# Altium schematic sheet CON_VIDEO_OUT.SchDoc: Video Out Connectors
size A4
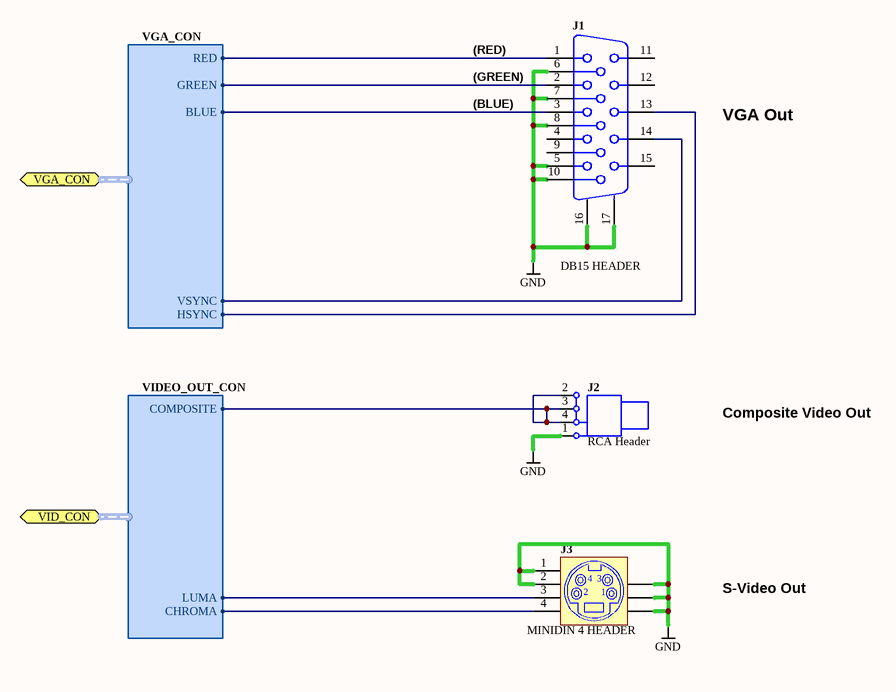
[diagram p0: CON_VIDEO_OUT.SchDoc]

## Parts
J1  DB15 HEADER  [DB15-VGA-Female]
J2  RCA Header  [TRC-005]
J3  MINIDIN 4 HEADER  [MDJ-F-04]

## Ports
VGA_CON (harness VGA_CON), VID_CON (harness VIDEO_OUT_CON)

## Harnesses
VGA_CON: RED, GREEN, BLUE, VSYNC, HSYNC
VIDEO_OUT_CON: COMPOSITE, LUMA, CHROMA

## Nets
GND: J1.5 J1.6 J1.7 J1.8 J1.10 J1.16(MH1) J1.17(MH2) J2.1(Black) J3.1(D) J3.2(A) J3.MH1 J3.MH2 J3.MH3
NetJ1_1: J1.1 ; port VGA_CON.RED
NetJ1_2: J1.2 ; port VGA_CON.GREEN
NetJ1_3: J1.3 ; port VGA_CON.BLUE
NetJ1_13: J1.13 ; port VGA_CON.HSYNC
NetJ1_14: J1.14 ; port VGA_CON.VSYNC
NetJ2_2: J2.2(Yellow) J2.3(White) J2.4(Red) ; port VID_CON.COMPOSITE
NetJ3_3: J3.3(H) ; port VID_CON.LUMA
NetJ3_4: J3.4(E) ; port VID_CON.CHROMA

Not connected (* = marked no-connect by the designer): J1 4 9 11 12 15

## Notes on the sheet
- (RED)
- (GREEN)
- (BLUE)
- VGA Out
- Composite Video Out
- S-Video Out
- Sheet Title
- Project Title
- Size:
- Date:
- A4
- Assy:
- Time:
- Revision:
- Sheet
- of
- File:

## Library data of the parts
J1 = D-300-0049: Connector, DB15 Right-Angle Female (Analog RGB Video)/Blue; Max Current: mA; Category: Connector; Connector type: Header; Mounting Technology: Through-Hole; Status: Production
J2 = D-300-0051: Connector, TRC-005-4 , RCA Phono Jack, Right Angle, Thru-Hole, Snap-In; Max Current: mA; Category: Connector; Connector type: Header; Mounting Technology: Through-Hole; Status: Unreleased
J3 = D-300-0050: Connector, 4850.241, Mini-DIN 4-Way, S-Video/Yellow; Max Current: mA; Category: Connector; Connector type: Header; Mounting Technology: Through-Hole; Status: Unreleased